# Altium schematic sheet OLED.SchDoc
size A4
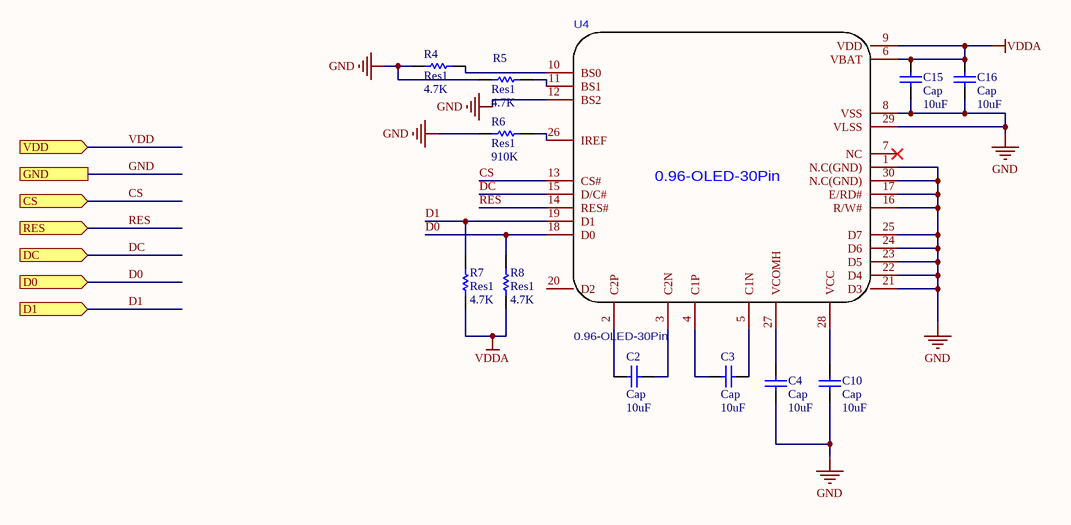
[diagram p0: OLED.SchDoc]

## Parts
C2  Cap  value 10uF  [R0603]
C3  Cap  value 10uF  [R0603]
C4  Cap  value 10uF  [R0603]
C10  Cap  value 10uF  [R0603]
C15  Cap  value 10uF  [R0603]
C16  Cap  value 10uF  [R0603]
R4  Res1  value 4.7K  [R0603]
R5  Res1  value 4.7K  [R0603]
R6  Res1  value 910K  [R0603]
R7  Res1  value 4.7K  [R0603]
R8  Res1  value 4.7K  [R0603]
U4  0.96-OLED-30Pin  [SSD1306]

## Ports
CS (in), D0 (in), D1 (in), DC (in), GND, RES (in), VDD (in)

## Nets
GND: C4.2 C10.2 C15.2 C16.2 R4.2 R5.2 R6.2 U4.1(N.C(GND)) U4.8(VSS) U4.12(BS2) U4.16(R/W#) U4.17(E/RD#) U4.21(D3) U4.22(D4) U4.23(D5) U4.24(D6) U4.25(D7) U4.29(VLSS) U4.30(N.C(GND)) ; port GND
VDDA: C15.1 C16.1 R7.2 R8.2 U4.6(VBAT) U4.9(VDD)
CS: U4.13(CS#) ; port CS
D0: R8.1 U4.18(D0) ; port D0
D1: R7.1 U4.19(D1) ; port D1
DC: U4.15(D/C#) ; port DC
RES: U4.14(RES#) ; port RES
VDD: port VDD
NetC2_1: C2.1 U4.3(C2N)
NetC2_2: C2.2 U4.2(C2P)
NetC3_1: C3.1 U4.5(C1N)
NetC3_2: C3.2 U4.4(C1P)
NetC4_1: C4.1 U4.27(VCOMH)
NetC10_1: C10.1 U4.28(VCC)
NetR4_1: R4.1 U4.10(BS0)
NetR5_1: R5.1 U4.11(BS1)
NetR6_1: R6.1 U4.26(IREF)

Not connected (* = marked no-connect by the designer): U4 7(NC)* 20(D2)

## Library data of the parts
C2-C4 C10 C15 C16 = Cap: Capacitor; Published: 8-Jun-2000; LatestRevisionDate: 17-Jul-2002; LatestRevisionNote: Re-released for DXP Platform.; PackageReference: RAD-0.3; Publisher: Altium Limited; PackageDescription: Radial Cap, Thru-Hole; 2 Leads; 0.3 in Pin Spacing
R4-R8 = Res1: Resistor; Published: 8-Jun-2000; LatestRevisionDate: 17-Jul-2002; LatestRevisionNote: Re-released for DXP Platform.; PackageReference: AXIAL-0.3; Publisher: Altium Limited; PackageDescription: Axial Device, Thru-Hole; 2 Leads; 0.3 in Pin Spacing